# EAGLE schematic SmartCam (EAGLE 9.0.1)
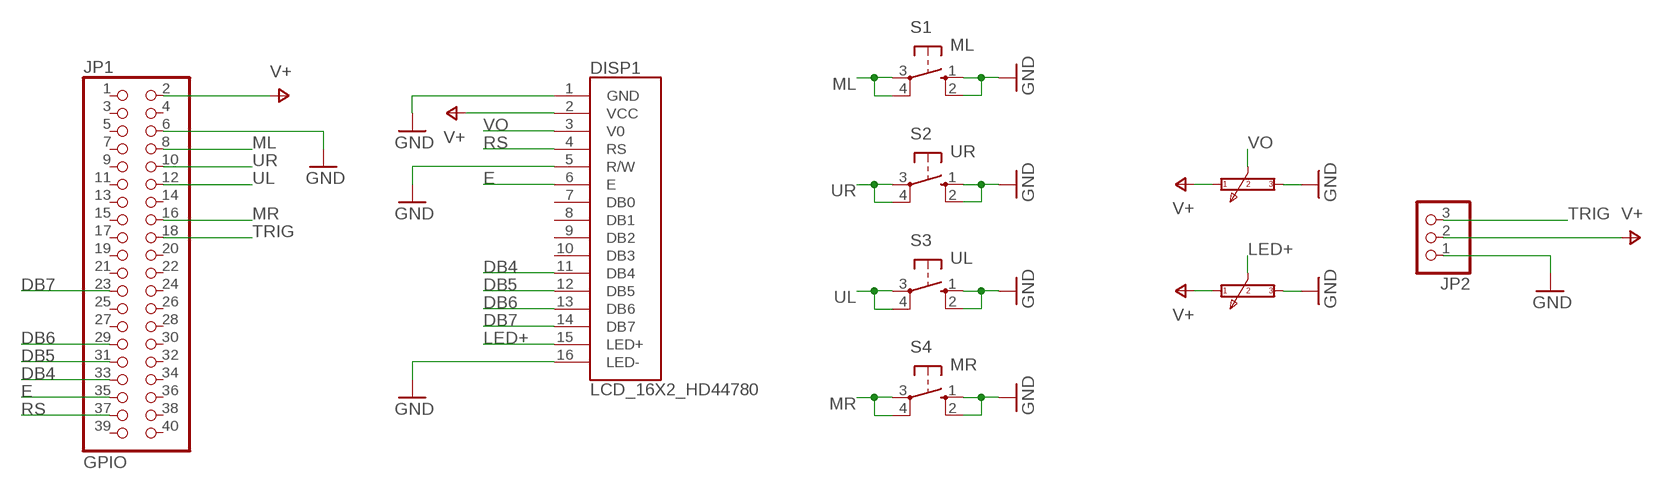
[diagram p0: schematic, sheet 1]

## Parts
DISP1  LCD_16X2_HD44780  [LCD_16X2_HD44780]
JP1  GPIO  PINHD-2X20  [2X20]
JP2  PINHD-1X3/90  [1X03/90]
POT1  10k  BOURNS_WEL3296_W_103  [BOURNS_WEL3296_W_103]
POT2  10k  BOURNS_WEL3296_W_103  [BOURNS_WEL3296_W_103]
S1  ML  10-XX  [B3F-10XX]
S2  UR  10-XX  [B3F-10XX]
S3  UL  10-XX  [B3F-10XX]
S4  MR  10-XX  [B3F-10XX]

## Nets
DB4: DISP1.11(DB4) JP1.33
DB5: DISP1.12(DB5) JP1.31
DB6: DISP1.13(DB6) JP1.29
DB7: DISP1.14(DB7) JP1.23
E: DISP1.6(E) JP1.35
GND: DISP1.1(GND) DISP1.5(R/W) DISP1.16(LED-) JP1.6 JP2.1 POT1.P$3 POT2.P$3 S1.1(S) S1.2(S1) S2.1(S) S2.2(S1) S3.1(S) S3.2(S1) S4.1(S) S4.2(S1)
LED+: DISP1.15(LED+) POT2.P$2
ML: JP1.8 S1.3(P) S1.4(P1)
MR: JP1.16 S4.3(P) S4.4(P1)
RS: DISP1.4(RS) JP1.37
TRIG: JP1.18 JP2.3
UL: JP1.12 S3.3(P) S3.4(P1)
UR: JP1.10 S2.3(P) S2.4(P1)
V+: DISP1.2(VCC) JP1.2 JP2.2 POT1.P$1 POT2.P$1
VO: DISP1.3(V0) POT1.P$2
Unconnected: DISP1.7(DB0) DISP1.8(DB1) DISP1.9(DB2) DISP1.10(DB3) JP1.1 JP1.3 JP1.4 JP1.5 JP1.7 JP1.9 JP1.11 JP1.13 JP1.14 JP1.15 JP1.17 JP1.19 JP1.20 JP1.21 JP1.22 JP1.24 JP1.25 JP1.26 JP1.27 JP1.28 JP1.30 JP1.32 JP1.34 JP1.36 JP1.38 JP1.39 JP1.40

## Library data of the parts
DISP1 = LCD_16x2_HD44780:LCD_16X2_HD44780
JP1 = pinhead:PINHD-2X20: PIN HEADER
JP2 = pinhead:PINHD-1X3: PIN HEADER
POT1 POT2 = BOURNS_WEL3296_W_103:BOURNS_WEL3296_W_103
S1-S4 = switch-omron:10-XX: OMRON SWITCH; MPN: B3F-1000; OC_FARNELL: 176432; OC_NEWARK: 36M3542